# EAGLE schematic fuil_oil_counter (EAGLE 6.6.0)
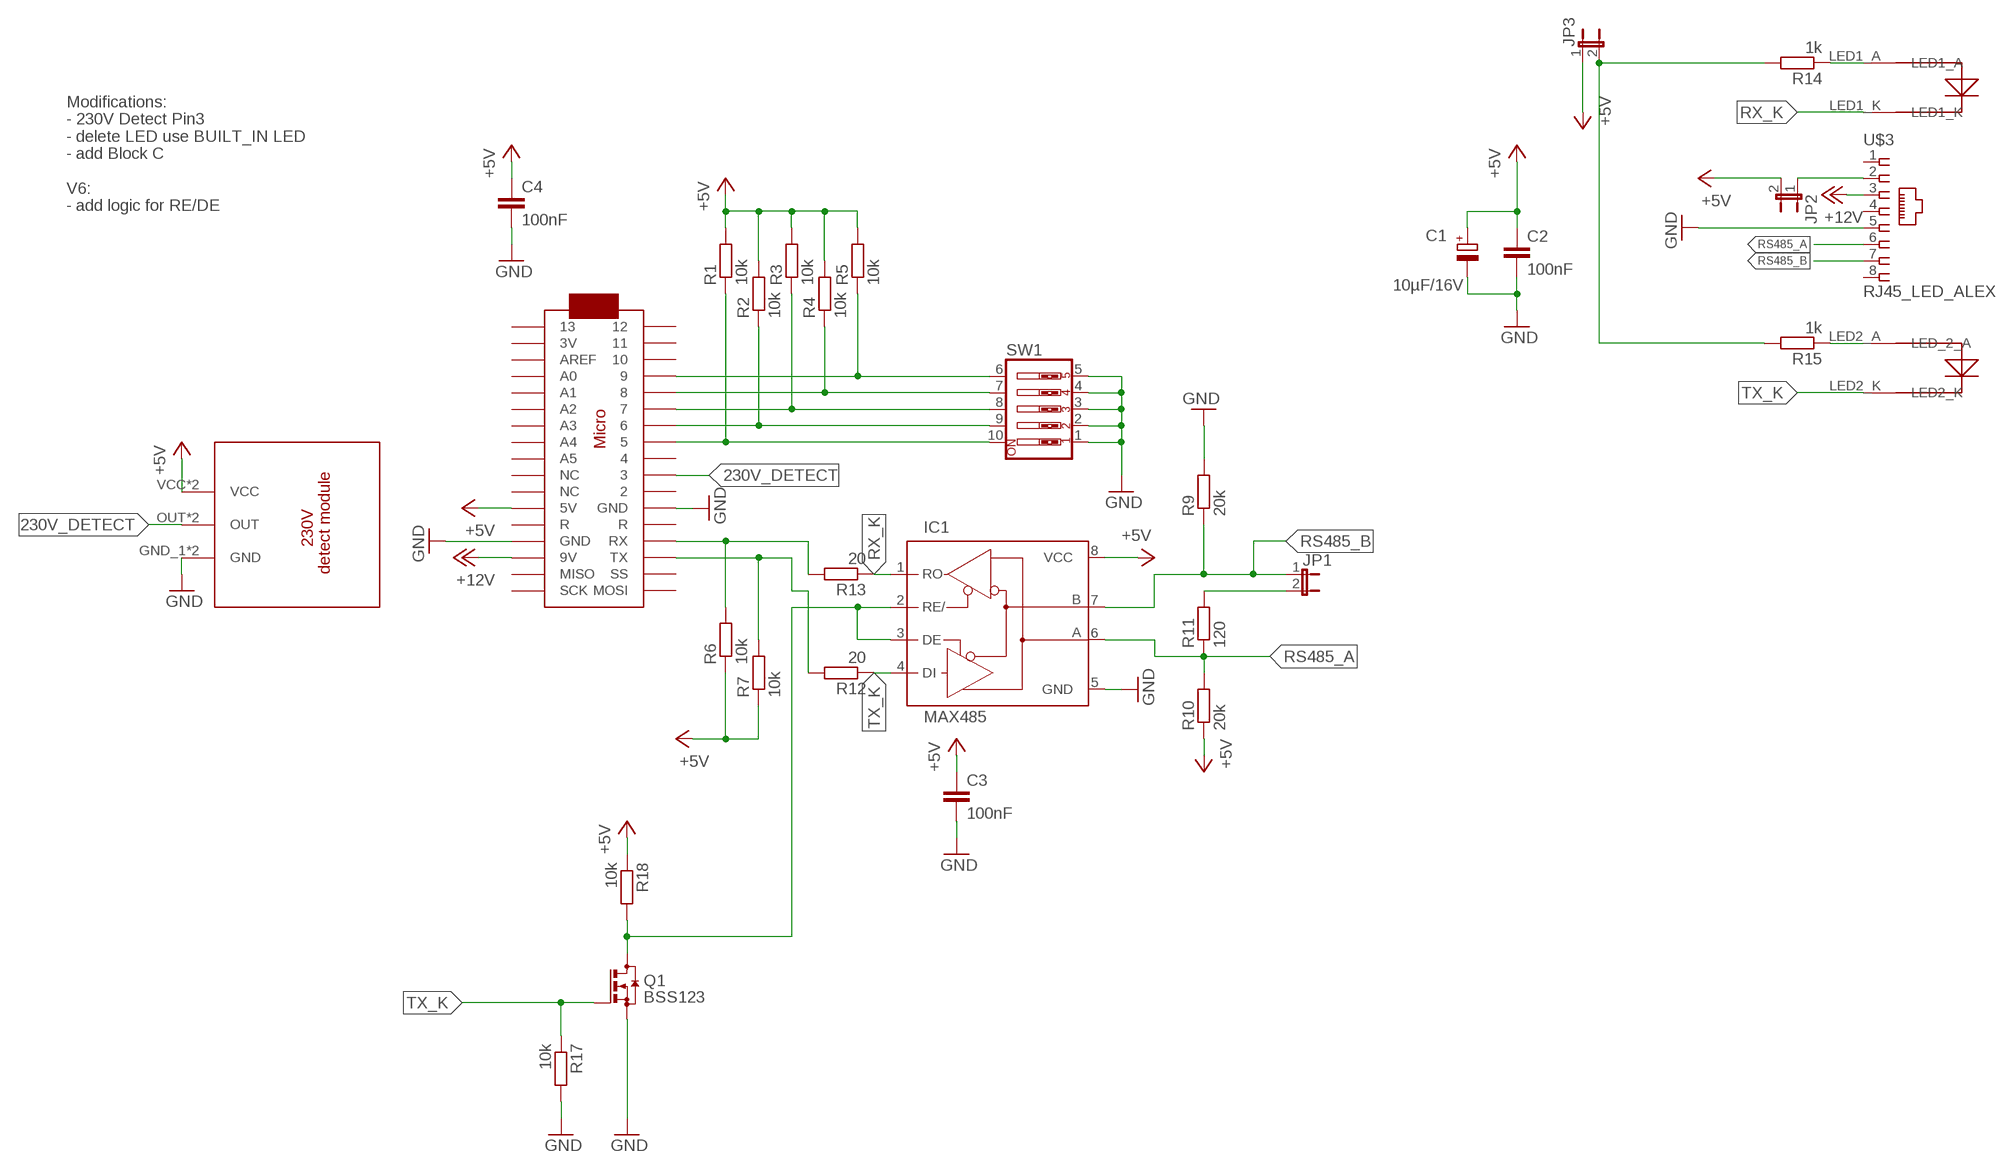
[diagram p0: schematic, sheet 1]

## Parts
C1  10µF/16V  CPOL-EUSMCC  [SMC_C]
C2  100nF  C-EUC0805  [C0805]
C3  100nF  C-EUC0805  [C0805]
C4  100nF  C-EUC0805  [C0805]
IC1  MAX485  MAX3468ESA  [SO08]
JP1  JP1E  [JP1]
JP2  JP1E  [JP1]
JP3  JP1E  [JP1]
Q1  BSS123  [SOT23]
R1  10k  R-EU_M0805  [M0805]
R2  10k  R-EU_M0805  [M0805]
R3  10k  R-EU_M0805  [M0805]
R4  10k  R-EU_M0805  [M0805]
R5  10k  R-EU_M0805  [M0805]
R6  10k  R-EU_M0805  [M0805]
R7  10k  R-EU_M0805  [M0805]
R9  20k  R-EU_M0805  [M0805]
R10  20k  R-EU_M0805  [M0805]
R11  120  R-EU_0613/15  [P0613/15]
R12  20  R-EU_M0805  [M0805]
R13  20  R-EU_M0805  [M0805]
R14  1k  R-EU_M0805  [M0805]
R15  1k  R-EU_M0805  [M0805]
R17  10k  R-EU_M0805  [M0805]
R18  10k  R-EU_M0805  [M0805]
SW1  SW_DIP-5  [EDG-05]
U$1  ARDUINOMICRO  [ARDUINOMICRO]
U$2  POWER_DETECT  [POWER_DETECT]
U$3  RJ45_LED_ALEX  [RJ45-NO-SHIELD-WITH_LED]

## Nets
230V_DETECT: U$1.P$10 U$2.OUT U$2.OUT_2(OUT)
+5V: C1.+ C2.1 C3.1 C4.1 IC1.8(VCC) JP2.2 JP3.1 R1.2 R2.2 R3.2 R4.2 R5.2 R6.1 R7.1 R10.1 R18.1 U$1.P$23(5V) U$2.VCC U$2.VCC_2(VCC)
+12V: U$1.P$20(9V) U$3.3
EN: IC1.2(RE/) IC1.3(DE) Q1.3(D) R18.2
GND: C1.- C2.2 C3.2 C4.2 IC1.5(GND) Q1.2(S) R9.2 R17.2 SW1.1 SW1.2 SW1.3 SW1.4 SW1.5 U$1.P$12(GND) U$1.P$21(GND) U$2.GND_1(GND) U$2.GND_PIN(GND) U$3.5
N$1: R1.1 SW1.10 U$1.P$8
N$2: R2.1 SW1.9 U$1.P$7
N$3: R3.1 SW1.8 U$1.P$6
N$4: R4.1 SW1.7 U$1.P$5
N$5: R5.1 SW1.6 U$1.P$4
N$6: JP2.1 U$3.2
N$7: JP1.2 R11.2
N$8: R14.1 U$3.LED1_A
N$9: R15.1 U$3.LED2_A(LED_2_A)
N$11: R6.2 R13.2 U$1.P$14(RX)
N$12: R7.2 R12.2 U$1.P$15(TX)
N$13: JP3.2 R14.2 R15.2
RS485_A: IC1.6(A) R10.2 R11.1 U$3.6
RS485_B: IC1.7(B) JP1.1 R9.1 U$3.7
RX_K: IC1.1(RO) R13.1 U$3.LED1_K
TX_K: IC1.4(DI) Q1.1(G) R12.1 R17.1 U$3.LED2_K
Unconnected: U$1.P$1 U$1.P$2 U$1.P$3 U$1.P$9 U$1.P$11 U$1.P$13(R) U$1.P$16(SS) U$1.P$17(MOSI) U$1.P$18(SCK) U$1.P$19(MISO) U$1.P$22(R) U$1.P$24(NC) U$1.P$25(NC) U$1.P$26(A5) U$1.P$27(A4) U$1.P$28(A3) U$1.P$29(A2) U$1.P$30(A1) U$1.P$31(A0) U$1.P$32(AREF) U$1.P$33(3V) U$1.P$34 U$3.1 U$3.4 U$3.8

## Notes on the sheet
- Modifications:
  - 230V Detect Pin3
  - delete LED use BUILT_IN LED
  - add Block C
  
  V6:
  - add logic for RE/DE

## Library data of the parts
C1 = rcl:CPOL-EU: POLARIZED CAPACITOR, European symbol
C2-C4 = rcl:C-EU: CAPACITOR, European symbol
IC1 = maxim:MAX34*: +5V, Fail-Safe, 40Mbps, Profibus RS-485/RS-422 Transceivers Source: MAX3465-MAX3469.pdf; MPN: MAX3468ESA+T; OC_FARNELL: unknown; OC_NEWARK: 76K6724
JP1-JP3 = jumper:JP1E: JUMPER
Q1 = transistor-small-signal:BSS123: N-CHANNEL MOS FET
R1-R7 R9-R15 = rcl:R-EU_: RESISTOR, European symbol
R17 R18 = resistor:R-EU_: RESISTOR, European symbol
SW1 = special:SW_DIP-5: DIP SWITCH
U$1 = adafruit:ARDUINOMICRO
U$2 = 1_Alex:POWER_DETECT: power module
U$3 = con-tycoelectronics:RJ45_LED_ALEX

## Net classes
0 default: clearance 0.25 mm